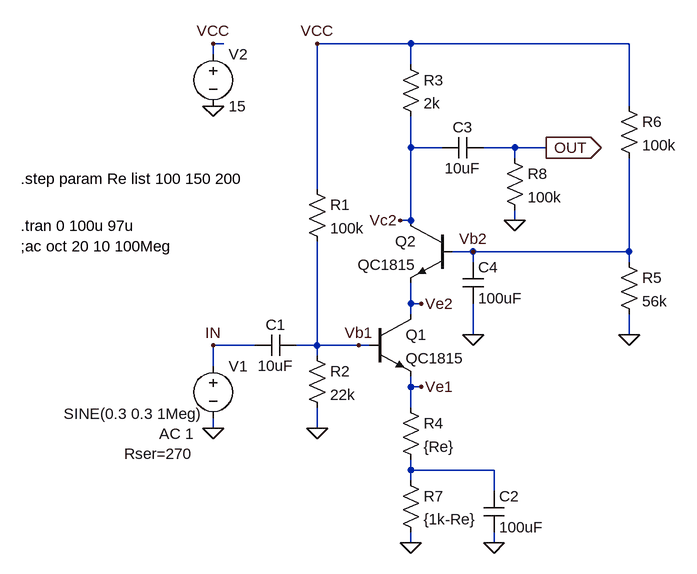
[diagram p0: schematic Cascode_15VPWR.asc]
Cascode_15VPWR.asc, the LTspice schematic file:
Version 4
SHEET 1 1048 704
WIRE 64 -96 48 -96
WIRE 352 -96 208 -96
WIRE 688 -96 352 -96
WIRE 48 -80 48 -96
WIRE 352 -64 352 -96
WIRE 688 0 688 -96
WIRE 352 64 352 16
WIRE 400 64 352 64
WIRE 512 64 464 64
WIRE 560 64 512 64
WIRE 512 80 512 64
WIRE 208 128 208 -96
WIRE 352 176 352 64
WIRE 352 176 336 176
WIRE 512 176 512 160
WIRE 448 224 416 224
WIRE 688 224 688 80
WIRE 688 224 448 224
WIRE 448 240 448 224
WIRE 688 240 688 224
WIRE 352 304 352 272
WIRE 368 304 352 304
WIRE 352 320 352 304
WIRE 448 352 448 304
WIRE 688 352 688 320
WIRE 112 368 48 368
WIRE 208 368 208 208
WIRE 208 368 176 368
WIRE 272 368 208 368
WIRE 288 368 272 368
WIRE 208 384 208 368
WIRE 48 400 48 368
WIRE 352 432 352 416
WIRE 368 432 352 432
WIRE 352 464 352 432
WIRE 48 496 48 480
WIRE 208 496 208 464
WIRE 352 560 352 544
WIRE 480 560 352 560
WIRE 352 576 352 560
WIRE 480 592 480 560
WIRE 352 672 352 656
WIRE 480 672 480 656
FLAG 480 672 0
FLAG 208 496 0
FLAG 688 352 0
FLAG 48 496 0
FLAG 48 368 IN
FLAG 560 64 OUT
IOPIN 560 64 Out
FLAG 48 0 0
FLAG 48 -96 VCC
FLAG 208 -96 VCC
FLAG 448 352 0
FLAG 352 672 0
FLAG 512 176 0
FLAG 448 224 Vb2
FLAG 336 176 Vc2
FLAG 272 368 Vb1
FLAG 368 304 Ve2
FLAG 368 432 Ve1
SYMBOL npn 416 176 M0
SYMATTR InstName Q2
SYMATTR Value QC1815
SYMBOL res 192 112 R0
SYMATTR InstName R1
SYMATTR Value 100k
SYMBOL res 192 368 R0
SYMATTR InstName R2
SYMATTR Value 22k
SYMBOL cap 464 592 R0
SYMATTR InstName C2
SYMATTR Value 100uF
SYMBOL res 336 -80 R0
SYMATTR InstName R3
SYMATTR Value 2k
SYMBOL res 336 448 R0
SYMATTR InstName R4
SYMATTR Value {Re}
SYMBOL res 672 224 R0
SYMATTR InstName R5
SYMATTR Value 56k
SYMBOL cap 176 352 R90
WINDOW 0 0 32 VBottom 2
WINDOW 3 32 32 VTop 2
SYMATTR InstName C1
SYMATTR Value 10uF
SYMBOL voltage 48 384 R0
WINDOW 123 -83 120 Left 2
WINDOW 39 -137 151 Left 2
WINDOW 3 -230 89 Left 2
SYMATTR Value2 AC 1
SYMATTR SpiceLine Rser=270
SYMATTR Value SINE(0.3 0.3 1Meg)
SYMATTR InstName V1
SYMBOL voltage 48 -96 R0
WINDOW 123 0 0 Left 2
WINDOW 39 0 0 Left 2
SYMATTR InstName V2
SYMATTR Value 15
SYMBOL npn 288 320 R0
SYMATTR InstName Q1
SYMATTR Value QC1815
SYMBOL cap 432 240 R0
SYMATTR InstName C4
SYMATTR Value 100uF
SYMBOL res 672 -16 R0
SYMATTR InstName R6
SYMATTR Value 100k
SYMBOL res 336 560 R0
SYMATTR InstName R7
SYMATTR Value {1k-Re}
SYMBOL cap 464 48 R90
WINDOW 0 0 32 VBottom 2
WINDOW 3 32 32 VTop 2
SYMATTR InstName C3
SYMATTR Value 10uF
SYMBOL res 496 64 R0
SYMATTR InstName R8
SYMATTR Value 100k
TEXT -248 184 Left 2 !.tran 0 100u 97u
TEXT -248 216 Left 2 !;ac oct 20 10 100Meg
TEXT -248 112 Left 2 !.step param Re list 100 150 200

The netlist it stands for:
* Cascode_15VPWR.asc
Q2 Vc2 Vb2 Ve2 0 QC1815
R1 VCC Vb1 100k
R2 Vb1 0 22k
C2 N001 0 100uF
R3 VCC Vc2 2k
R4 Ve1 N001 {Re}
R5 Vb2 0 56k
C1 Vb1 IN 10uF
V1 IN 0 SINE(0.3 0.3 1Meg) AC 1 Rser=270
V2 VCC 0 15
Q1 Ve2 Vb1 Ve1 0 QC1815
C4 Vb2 0 100uF
R6 VCC Vb2 100k
R7 N001 0 {1k-Re}
C3 OUT Vc2 10uF
R8 OUT 0 100k
.model NPN NPN
.model PNP PNP
.lib standard.bjt
.tran 0 100u 97u
;ac oct 20 10 100Meg
.step param Re list 100 150 200
.backanno
.end